# EAGLE design SparkyJrRemorandum (EAGLE 6.2)
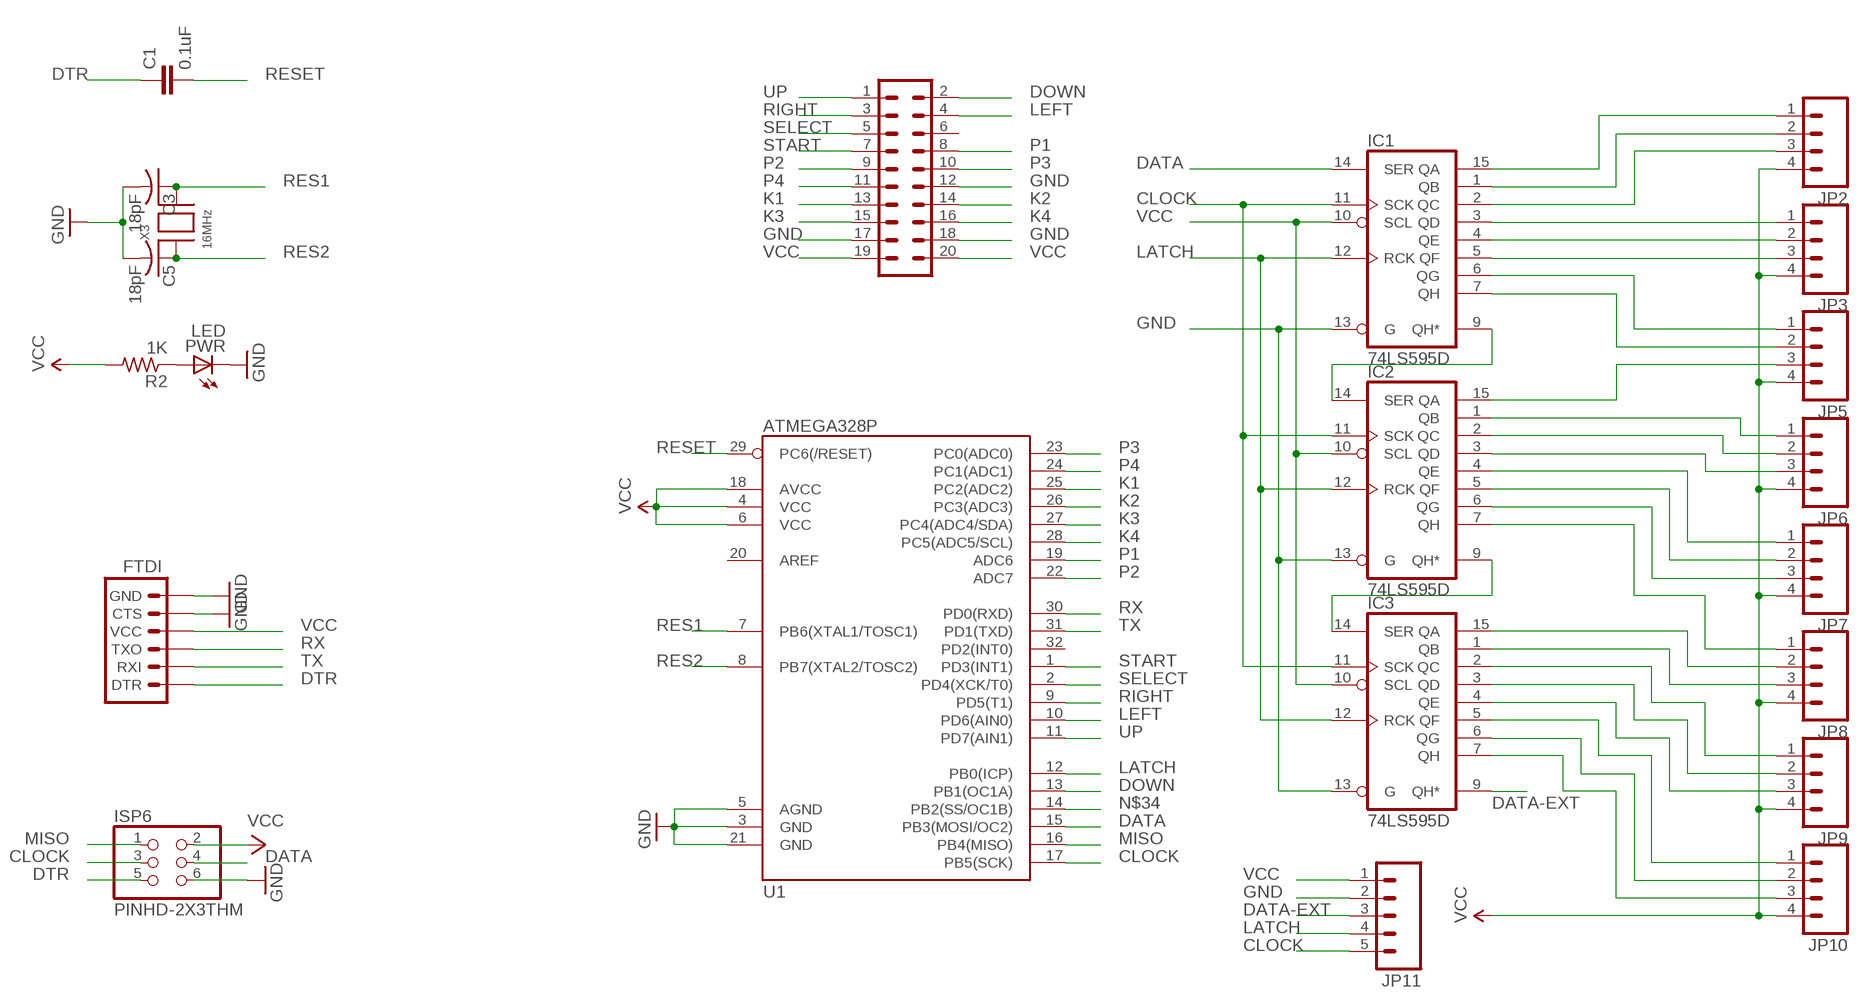
[diagram p0: schematic, sheet 1]

## Parts
C1  0.1uF  CAP0805  [0805]
C3  18pF  C-USC0805K  [C0805K]
C5  18pF  C-USC0805K  [C0805K]
FTDI  ARDUINO_SERIAL_PROGRAMPTH  [1X06]
IC1  74LS595D  [SO16]
IC2  74LS595D  [SO16]
IC3  74LS595D  [SO16]
ISP6  PINHD-2X3THM  PINHD-2X3  [2X03]
JP2  M04PTH  [1X04]
JP3  M04PTH  [1X04]
JP5  M04PTH  [1X04]
JP6  M04PTH  [1X04]
JP7  M04PTH  [1X04]
JP8  M04PTH  [1X04]
JP9  M04PTH  [1X04]
JP10  M04PTH  [1X04]
JP11  M05PTH  [1X05]
PWR  LED  LEDCHIPLED_0805  [CHIPLED_0805]
R2  1K  R-US_R0805  [R0805]
U1  ATMEGA328P  ATMEGA168  [TQFP32-08]
U$1  M10X2NOSILK  [2X10_NOSILK]
X3  16MHz  XTALNX5032  [NX5032]

## Nets
CLOCK: IC1.11(SCK) IC2.11(SCK) IC3.11(SCK) ISP6.3 JP11.5 U1.17(PB5(SCK))
DATA: IC1.14(SER) ISP6.4 U1.15(PB3(MOSI/OC2))
DATA-EXT: IC3.9(QH*) JP11.3
DOWN: U1.13(PB1(OC1A)) U$1.2
DTR: C1.1 FTDI.1(DTR) ISP6.5
GND: C3.2 C5.2 FTDI.5(CTS) FTDI.6(GND) IC1.13(G) IC2.13(G) IC3.13(G) ISP6.6 JP11.2 PWR.C U1.3(GND) U1.5(AGND) U1.21(GND) U$1.12 U$1.17 U$1.18
K1: U1.25(PC2(ADC2)) U$1.13
K2: U1.26(PC3(ADC3)) U$1.14
K3: U1.27(PC4(ADC4/SDA)) U$1.15
K4: U1.28(PC5(ADC5/SCL)) U$1.16
LATCH: IC1.12(RCK) IC2.12(RCK) IC3.12(RCK) JP11.4 U1.12(PB0(ICP))
LEFT: U1.10(PD6(AIN0)) U$1.4
MISO: ISP6.1 U1.16(PB4(MISO))
N$1: PWR.A R2.1
N$2: IC1.9(QH*) IC2.14(SER)
N$3: IC2.9(QH*) IC3.14(SER)
N$4: IC1.15(QA) JP2.1
N$5: IC1.1(QB) JP2.2
N$6: IC1.2(QC) JP2.3
N$7: IC1.3(QD) JP3.1
N$8: IC1.4(QE) JP3.2
N$9: IC1.5(QF) JP3.3
N$10: IC1.6(QG) JP5.1
N$11: IC1.7(QH) JP5.2
N$12: IC2.15(QA) JP5.3
N$13: IC2.1(QB) JP6.1
N$14: IC2.2(QC) JP6.2
N$15: IC2.3(QD) JP6.3
N$16: IC2.4(QE) JP7.1
N$17: IC2.5(QF) JP7.2
N$18: IC2.6(QG) JP7.3
N$19: IC2.7(QH) JP8.1
N$20: IC3.15(QA) JP8.2
N$21: IC3.1(QB) JP8.3
N$22: IC3.2(QC) JP9.1
N$23: IC3.3(QD) JP9.2
N$24: IC3.4(QE) JP9.3
N$25: IC3.5(QF) JP10.1
N$26: IC3.6(QG) JP10.2
N$27: IC3.7(QH) JP10.3
N$34: U1.14(PB2(SS/OC1B))
P1: U1.19(ADC6) U$1.8
P2: U1.22(ADC7) U$1.9
P3: U1.23(PC0(ADC0)) U$1.10
P4: U1.24(PC1(ADC1)) U$1.11
RES1: C3.1 U1.7(PB6(XTAL1/TOSC1)) X3.P$2
RES2: C5.1 U1.8(PB7(XTAL2/TOSC2)) X3.P$1
RESET: C1.2 U1.29(PC6(/RESET))
RIGHT: U1.9(PD5(T1)) U$1.3
RX: FTDI.3(TXO) U1.30(PD0(RXD))
SELECT: U1.2(PD4(XCK/T0)) U$1.5
START: U1.1(PD3(INT1)) U$1.7
TX: FTDI.2(RXI) U1.31(PD1(TXD))
UP: U1.11(PD7(AIN1)) U$1.1
VCC: FTDI.4(VCC) IC1.10(SCL) IC2.10(SCL) IC3.10(SCL) ISP6.2 JP2.4 JP3.4 JP5.4 JP6.4 JP7.4 JP8.4 JP9.4 JP10.4 JP11.1 R2.2 U1.4(VCC) U1.6(VCC) U1.18(AVCC) U$1.19 U$1.20
Unconnected: U1.20(AREF) U1.32(PD2(INT0)) U$1.6

## Power pins joined to a net without a drawn wire
GND: IC1.8(GND) IC2.8(GND) IC3.8(GND)
VCC: IC1.16(VCC) IC2.16(VCC) IC3.16(VCC)

## Library data of the parts
C1 = SparkFun:CAP: Capacitor Standard 0603 ceramic capacitor, and 0.1" leaded capacitor.
C3 C5 = adafruit:C-US: CAPACITOR, American symbol
FTDI = SparkFun:ARDUINO_SERIAL_PROGRAM
IC1-IC3 = 74xx-us:74*595: 8-bit SHIFT REGISTER, output latch
ISP6 = SparkFun:PINHD-2X3: PIN HEADER
JP2 JP3 JP5-JP10 = SparkFun:M04: Header 4 Standard 4-pin 0.1" header. Use with straight break away headers (SKU : PRT-00116), right angle break away headers (PRT-00553), swiss pins (PRT-00743), machine pins (PRT-00117), and female headers (PRT-00115). Molex polarized connector foot print use with SKU : PRT-08231 with associated crimp pins and housings. 1MM SMD Version SKU: PRT-10208
JP11 = SparkFun:M05: Header 5 Standard 5-pin 0.1" header. Use with straight break away headers (SKU : PRT-00116), right angle break away headers (PRT-00553), swiss pins (PRT-00743), machine pins (PRT-00117), and female headers (PRT-00115). Molex polarized connector foot print use with SKU : PRT-08230 with associated crimp pins and housings.
PWR = adafruit:LED: LED OSRAM: - CHIPLED LG R971, LG N971, LY N971, LG Q971, LY Q971, LO R971, LY R971 LH N974, LH R974 LS Q976, LO Q976, LY Q976 LO Q996 - Hyper CHIPLED LW Q18S LB Q993, LB Q99A, LB R99A - SideLED LS A670, LO A670, LY A670, LG A670, LP A670 LB A673, LV A673, LT A673, LW A673 LH A674 LY A675 LS A676, LA A676, LO A676, LY A676, LW A676 LS A679, LY A679, LG A679 - Hyper Micro SIDELED® LS Y876, LA Y876, LO Y876, LY Y876 LT Y87S - SmartLED LW L88C, LW L88S LB L89C, LB L89S, LG L890 LS L89K, LO L89K, LY L89K LS L896, LA L896, LO L896, LY L896 - TOPLED LS T670, LO T670, LY T670, LG T670, LP T670 LSG T670, LSP T670, LSY T670, LOP T670, LYG T670 LG T671, LOG T671, LSG T671 LB T673, LV T673, LT T673, LW T673 LH T674 LS T676, LA T676, LO T676, LY T676, LB T676, LH T676, LSB T676, LW T676 LB T67C, LV T67C, LT T67C, LS T67K, LO T67K, LY T67K, LW E67C LS E67B, LA E67B, LO E67B, LY E67B, LB E67C, LV E67C, LT E67C LW T67C LS T679, LY T679, LG T679 LS T770, LO T770, LY T770, LG T770, LP T770 LB T773, LV T773, LT T773, LW T773 LH T774 LS E675, LA E675, LY E675, LS T675 LS T776, LA T776, LO T776, LY T776, LB T776 LHGB T686 LT T68C, LB T68C - Hyper Mini TOPLED® LB M676 - Mini TOPLED Santana® LG M470 LS M47K, LO M47K, LY M47K Source: http://www.osram.convergy.de/
R2 = adafruit:R-US_: RESISTOR, American symbol
U1 = SparkFun:ATMEGA168
U$1 = SparkFun:M10X2: This was SPECIALLY designed to be used with our Graphic LCD Backpack. Be sure you want to use this! It is not only staggered on each line of header holes, but IT IS ALSO offset of the center point of the top and bottom lines by 5 mil. This causes the headers to lock into place on the "standard" footprint on the LCD screen. The extra squares on the tdocu layer are there simply to reference other pins (if you were to actually populate a longer header than ten long - this is what we do with the backpacks).
X3 = adaprog:XTAL

## Board
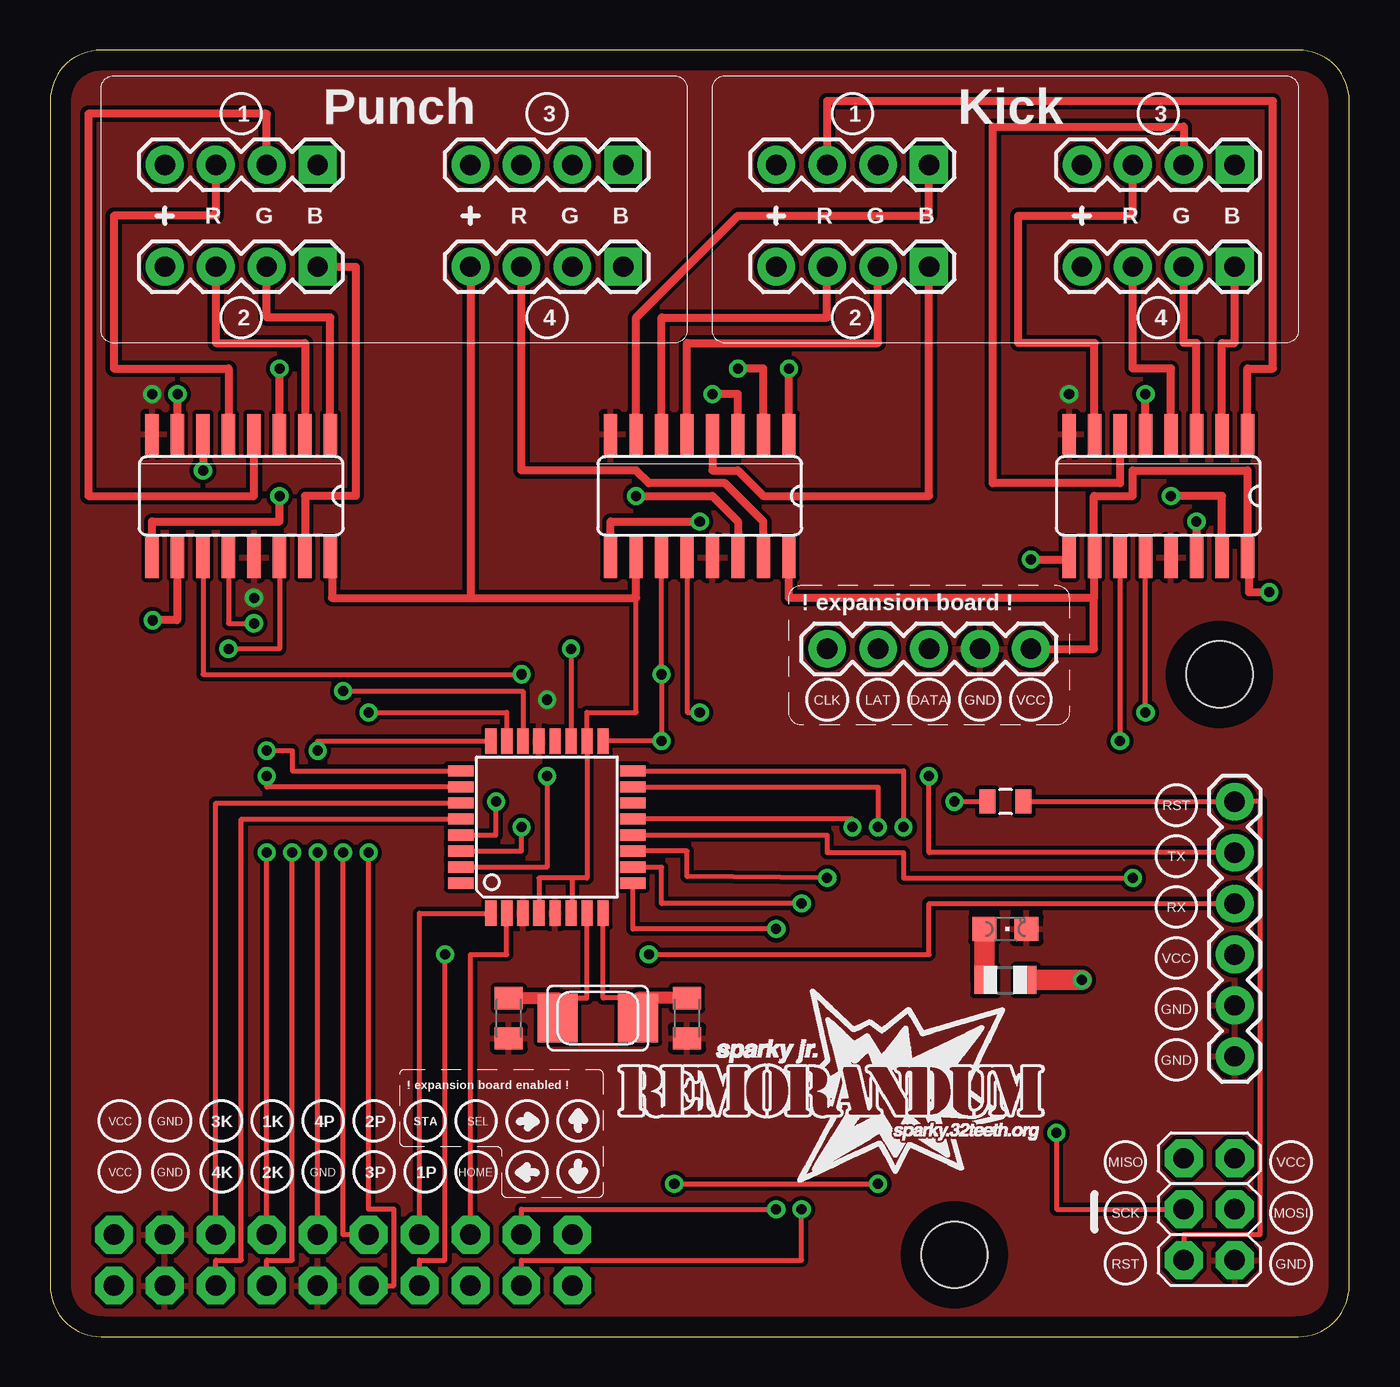
[diagram p1: board, top side]
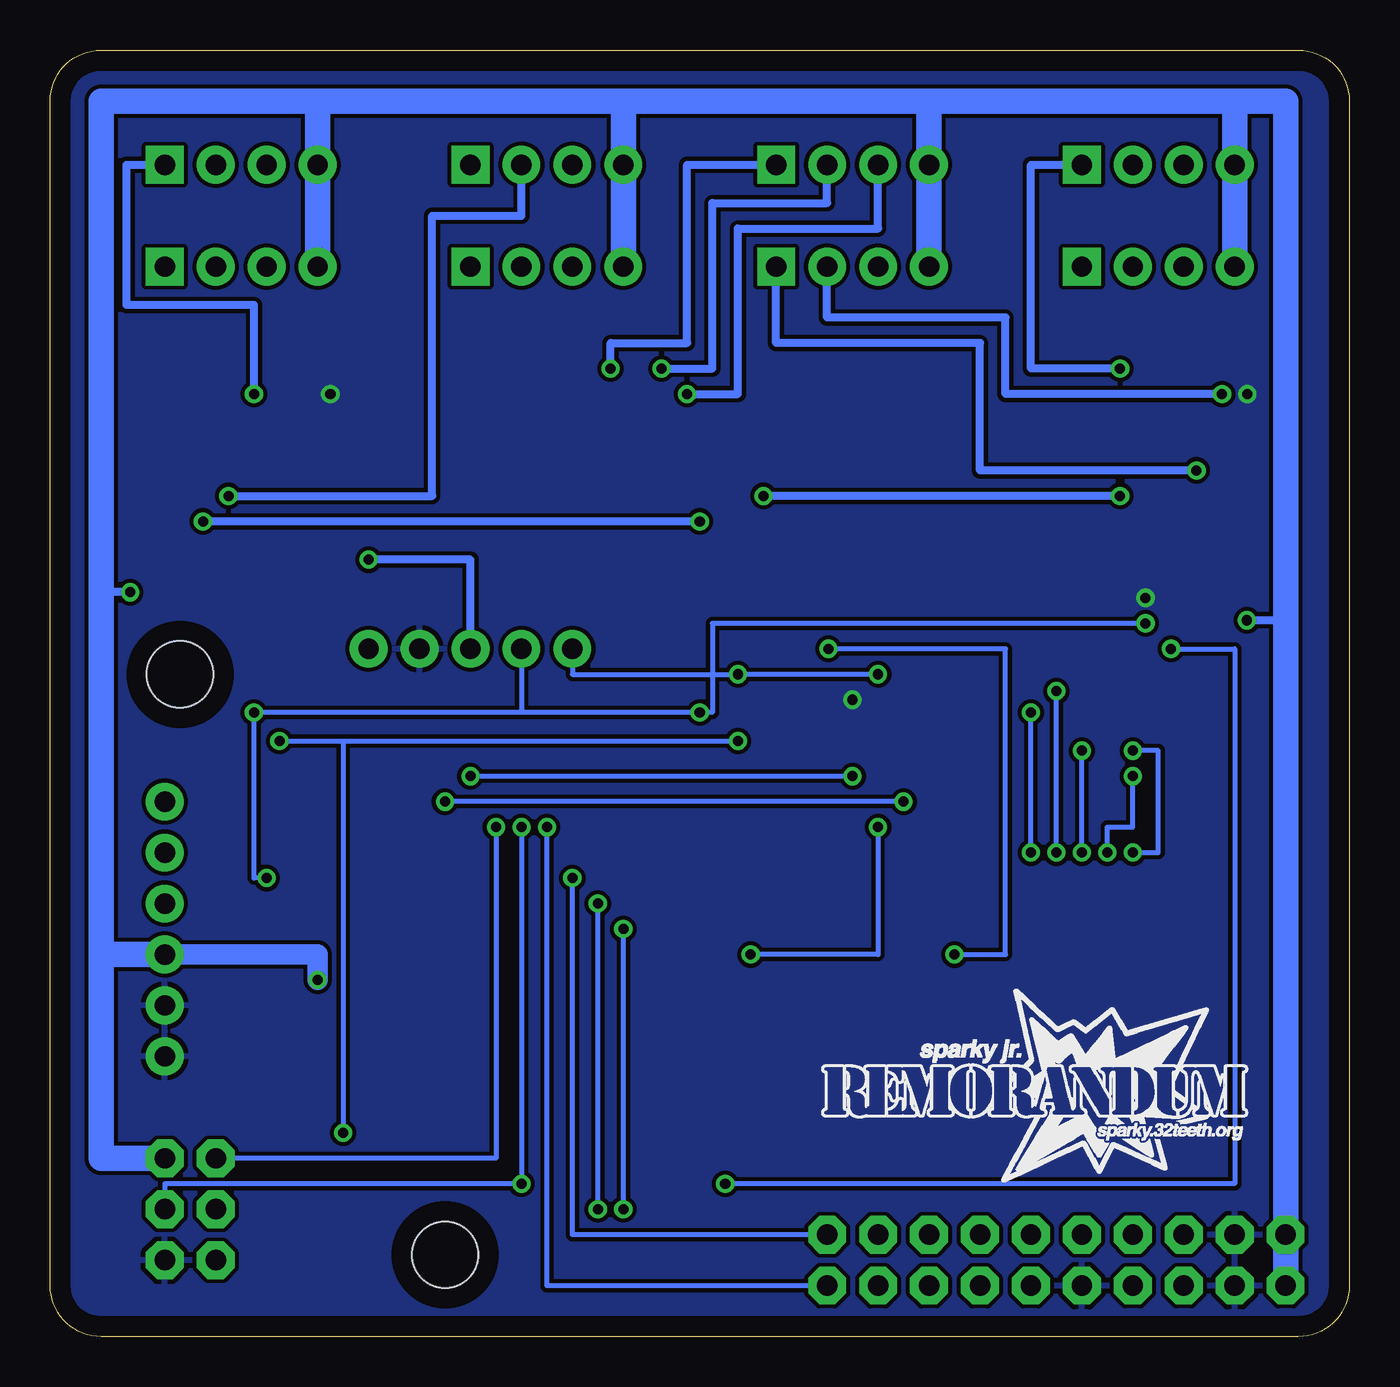
[diagram p2: board, bottom side, seen from below]

Size 64.77 x 64.14 mm. Coordinates in mm from the lower left corner, seen from the top.
Outline: 64.77,2.54 64.77,61.59 arc90 62.23,64.14 2.54,64.14 arc90 0,61.59 0,2.54 arc90 2.54,0 62.23,0 arc90 64.77,2.54
Copper layers (1*16): Top 0.035mm / dielectric 1.5mm / Bottom 0.035mm
Design rules: minimum track width 10mil, minimum drill 24mil, track to track 8mil, track to pad 8mil, pad to pad 8mil, via to via 8mil, smd to smd 8mil, copper to edge 40mil, drill to drill 8mil, minimum pad ring 10mil, minimum via ring 8mil, stop-mask expansion 4mil, vias tented up to drill 0mil, thermal gap 10mil

### Footprints (pad centres in the part's own frame; a part is rotated, then mirrored left to right if it is on the bottom)
0805 = smd 0.8 x 1.2: 1 -0.9,0; 2 0.9,0
C0805K = smd 1.1 x 1.4: 1 -1,0; 2 1,0
1X06 = drill 1.016 pad 1.88: 1 0,0; 2 2.54,0; 3 5.08,0; 4 7.62,0; 5 10.16,0; 6 12.7,0
SO16 = smd 0.66 x 2.032: 1 -4.445,-3.073; 2 -3.175,-3.073; 3 -1.905,-3.073; 4 -0.635,-3.073; 5 0.635,-3.073; 6 1.905,-3.073; 7 3.175,-3.073; 8 4.445,-3.073; 9 4.445,3.073; 10 3.175,3.073; 11 1.905,3.073; 12 0.635,3.073; 13 -0.635,3.073; 14 -1.905,3.073; 15 -3.175,3.073; 16 -4.445,3.073
2X03 = drill 1.016 pad 1.88 octagon: 1 -2.54,-1.27; 2 -2.54,1.27; 3 0,-1.27; 4 0,1.27; 5 2.54,-1.27; 6 2.54,1.27
STAND-OFF = hole 3.302: 0,0
1X04 = drill 1.016 pad 1.88 square: 1 0,0 | drill 1.016 pad 1.88: 2 2.54,0; 3 5.08,0; 4 7.62,0
1X05 = drill 1.016 pad 1.88: 1 0,0; 2 2.54,0; 3 5.08,0; 4 7.62,0; 5 10.16,0
CHIPLED_0805 = smd 1.2 x 1.2: A 0,-1.05; C 0,1.05
R0805 = smd 1.1 x 1.4: 1 -1,0; 2 1,0
TQFP32-08 = smd 1.27 x 0.559: 1 -4.293,2.8; 2 -4.293,2; 3 -4.293,1.2; 4 -4.293,0.4; 5 -4.293,-0.4; 6 -4.293,-1.2; 7 -4.293,-2; 8 -4.293,-2.8; 17 4.293,-2.8; 18 4.293,-2; 19 4.293,-1.2; 20 4.293,-0.4; 21 4.293,0.4; 22 4.293,1.2; 23 4.293,2; 24 4.293,2.8 | smd 0.559 x 1.27: 9 -2.8,-4.293; 10 -2,-4.293; 11 -1.2,-4.293; 12 -0.4,-4.293; 13 0.4,-4.293; 14 1.2,-4.293; 15 2,-4.293; 16 2.8,-4.293; 25 2.8,4.293; 26 2,4.293; 27 1.2,4.293; 28 0.4,4.293; 29 -0.4,4.293; 30 -1.2,4.293; 31 -2,4.293; 32 -2.8,4.293
2X10_NOSILK = drill 1.016 pad 1.88 octagon: 1 -11.43,-1.27; 2 -11.43,1.27; 3 -8.89,-1.27; 4 -8.89,1.27; 5 -6.35,-1.27; 6 -6.35,1.27; 7 -3.81,-1.27; 8 -3.81,1.27; 9 -1.27,-1.27; 10 -1.27,1.27; 11 1.27,-1.27; 12 1.27,1.27; 13 3.81,-1.27; 14 3.81,1.27; 15 6.35,-1.27; 16 6.35,1.27; 17 8.89,-1.27; 18 8.89,1.27; 19 11.43,-1.27; 20 11.43,1.27
NX5032 = smd 2 x 2.4: P$1 2,0; P$2 -2,0

### Placement (x,y rotation side)
C1  47.62,26.67 180 top
C3  22.86,15.88 270 top
C5  31.75,15.88 270 top
FTDI  59.05,26.67 270 top
IC1  9.53,41.91 180 top
IC2  32.38,41.91 180 top
IC3  55.24,41.91 180 top
ISP6  57.78,6.35 270 top
JP1  STAND-OFF  [STAND-OFF]  58.29,33.02 0 top
JP2  13.34,53.34 180 top
JP3  13.34,58.42 180 top
JP4  STAND-OFF  [STAND-OFF]  45.09,4.08 0 top
JP5  28.57,53.34 180 top
JP6  28.57,58.42 180 top
JP7  43.81,53.34 180 top
JP8  43.81,58.42 180 top
JP9  59.05,53.34 180 top
JP10  59.05,58.42 180 top
JP11  48.9,34.29 180 top
PWR  47.62,20.32 270 top
R2  47.62,17.78 0 top
U1  24.77,25.4 90 top
U$1  14.61,3.81 180 top
X3  27.3,15.88 0 top

### Tracks (layer width: path | path; a pad name or v marks a point on that pad's centre or on a via)
CLOCK  (via drill 0.5)
  Top 0.254: IC3.11 v53.34,29.69 | IC2.11 v30.48,33.02 v30.48,29.69 U1.17 | IC1.11 7.62,33.02 v23.5,33.02 | v50.16,10.16 50.16,6.35 ISP6.3
  Bottom 0.254: v30.48,29.69 v53.34,29.69 50.16,29.69 v50.16,10.16 | v23.5,33.02 v30.48,33.02 38.73,33.02 JP11.5
DATA  (via drill 0.5)
  Top 0.254: U1.15 41.27,27.4 v41.27,25.4 | IC1.14 11.43,34.29 v8.89,34.29 | v31.11,7.62 v41.27,7.62
  Bottom 0.254: v41.27,25.4 v41.27,7.62 59.05,7.62 ISP6.4 | v8.89,34.29 5.71,34.29 5.71,7.62 v31.11,7.62
DATA-EXT  (via drill 0.5)
  Top 0.406: v48.9,38.73 50.8,38.73 IC3.9
  Bottom 0.406: JP11.3 43.81,38.73 v48.9,38.73
DOWN  (via drill 0.5)
  Top 0.254: v40.01,25.4 40.01,25.8 U1.13
  Bottom 0.254: U$1.2 40.01,2.54 v40.01,25.4
DTR
  Top 0.254: C1.1 FTDI.1 60.33,26.67 60.33,5.08 56.52,5.08 ISP6.5
GND  (via drill 0.5)
  other vias: 5.08,46.99 50.8,46.99 24.77,31.75 10.16,36.83
  pour Top: 0,64.14 64.77,64.14 64.77,0 0,0
  pour Bottom: 0,64.14 64.77,64.14 64.77,0 0,0
K1  (via drill 0.5)
  Top 0.254: U$1.13 v10.79,24.13 | v10.79,29.21 12.06,29.21 12.06,28.2 U1.25
  Bottom 0.254: v10.79,24.13 9.53,24.13 9.53,29.21 v10.79,29.21
K2  (via drill 0.5)
  Top 0.254: U$1.14 10.79,3.81 12.06,3.81 v12.06,24.13 | U1.26 10.79,27.4 v10.79,27.94
  Bottom 0.254: v12.06,24.13 12.06,25.4 10.79,25.4 v10.79,27.94
K3
  Top 0.254: U$1.15 8.26,26.6 U1.27
K4
  Top 0.254: U$1.16 8.26,3.81 9.53,3.81 9.53,25.8 U1.28
LATCH  (via drill 0.5)
  Top 0.254: U1.12 38.73,25 38.73,24.13 42.55,24.13 42.55,22.86 v53.98,22.86 | v54.61,31.11 IC3.12 | IC2.12 31.75,31.11 v32.38,31.11 | IC1.12 8.89,35.56 v10.16,35.56
  Bottom 0.254: v53.98,22.86 54.61,22.86 v54.61,31.11 41.27,31.11 | 41.27,31.11 v32.38,31.11 31.75,31.11 31.75,35.56 v10.16,35.56 | JP11.4 41.27,31.11
LEFT  (via drill 0.5)
  Top 0.254: U$1.4 23.5,3.81 37.47,3.81 v37.47,6.35 | v37.47,21.59 30.48,21.59 30.48,23.4 U1.10
  Bottom 0.254: v37.47,6.35 v37.47,21.59
MISO  (via drill 0.5)
  Top 0.254: U1.16 42.55,28.2 v42.55,25.4
  Bottom 0.254: v42.55,25.4 42.55,8.89 ISP6.1
N$1
  Top 1.016: R2.1 46.58,17.78 PWR.A
N$2  (via drill 0.5)
  Top 0.406: IC1.9 5.08,40.64 11.43,40.64 v11.43,41.91 | v29.21,41.91 33.02,41.91 34.29,40.64 IC2.14
  Bottom 0.406: v11.43,41.91 v29.21,41.91
N$3  (via drill 0.5)
  Top 0.406: IC2.9 27.94,40.64 v32.38,40.64 | v57.15,40.64 IC3.14
  Bottom 0.406: v32.38,40.64 v57.15,40.64
N$4
  Top 0.406: JP2.1 15.24,53.34 15.24,41.91 12.7,41.91 IC1.15
N$5
  Top 0.406: IC1.1 13.97,50.8 10.79,50.8 JP2.2
N$6
  Top 0.406: JP2.3 8.26,49.53 12.7,49.53 IC1.2
N$7  (via drill 0.5)
  Top 0.406: IC1.3 v11.43,48.26
  Bottom 0.406: v11.43,48.26 15.88,48.26 15.88,58.42 JP3.1
N$8
  Top 0.254: 9.98,44.91 IC1.4
  Top 0.406: JP3.2 10.79,60.96 1.91,60.96 1.91,41.91 10.16,41.91 IC1.4
N$9
  Top 0.406: JP3.3 8.26,55.88 3.17,55.88 3.17,48.26 8.89,48.26 IC1.5
N$10  (via drill 0.5)
  Top 0.406: IC1.6 v7.62,43.18
  Bottom 0.406: v7.62,43.18 18.41,43.18 18.41,49.53 28.57,49.53 JP5.1
N$11  (via drill 0.5)
  Top 0.406: IC1.7 v6.35,46.99
  Bottom 0.406: v6.35,46.99 17.14,46.99 17.14,50.8 26.04,50.8 JP5.2
N$12
  Top 0.406: IC2.15 35.56,40.64 33.66,42.55 29.84,42.55 29.21,43.18 23.5,43.18 JP5.3
N$13  (via drill 0.5)
  Top 0.406: IC2.1 v36.83,48.26
  Bottom 0.406: v36.83,48.26 36.83,49.53 33.02,49.53 33.02,58.42 JP6.1
N$14  (via drill 0.5)
  Top 0.406: IC2.2 35.56,48.26 v34.29,48.26
  Bottom 0.406: v34.29,48.26 31.75,48.26 31.75,56.52 26.04,56.52 JP6.2
N$15  (via drill 0.5)
  Top 0.406: IC2.3 34.29,46.99 v33.02,46.99
  Bottom 0.406: v33.02,46.99 30.48,46.99 30.48,55.24 23.5,55.24 JP6.3
N$16
  Top 0.406: IC2.4 33.02,43.18 34.29,43.18 35.56,41.91 43.81,41.91 JP7.1
N$17
  Top 0.406: IC2.5 31.75,49.53 41.27,49.53 JP7.2
N$18
  Top 0.406: IC2.6 30.48,50.8 38.73,50.8 JP7.3
N$19
  Top 0.406: IC2.7 29.21,50.8 34.29,55.88 43.81,55.88 JP8.1
N$20  (via drill 0.5)
  Top 0.406: IC3.15 58.42,41.91 v55.88,41.91
  Bottom 0.406: v55.88,41.91 45.72,41.91 45.72,55.88 41.27,55.88 JP8.2
N$21
  Top 0.406: IC3.1 59.69,48.26 60.96,48.26 60.96,61.59 38.73,61.59 JP8.3
N$22
  Top 0.406: IC3.2 58.42,49.53 59.05,49.53 JP9.1
N$23
  Top 0.406: IC3.3 57.15,49.53 56.52,49.53 JP9.2
N$24
  Top 0.406: IC3.4 55.88,48.26 53.98,48.26 JP9.3
N$25  (via drill 0.5)
  Top 0.406: IC3.5 v54.61,46.99
  Bottom 0.406: v54.61,46.99 54.61,51.44 60.96,51.44 60.96,58.42 JP10.1
N$26
  Top 0.406: IC3.6 53.34,42.55 46.99,42.55 46.99,60.33 56.52,60.33 JP10.2
N$27
  Top 0.406: IC3.7 52.07,49.53 48.26,49.53 48.26,55.88 53.98,55.88 JP10.3
P1  (via drill 0.5)
  Top 0.254: U$1.8 18.41,3.81 19.68,3.81 v19.68,19.05 | v25.96,34.29 U1.19
  Bottom 0.254: v19.68,19.05 17.14,19.05 17.14,34.29 v25.96,34.29
P2  (via drill 0.5)
  Top 0.254: U$1.9 14.61,5.08 v14.61,24.13 | v14.61,32.18 23.57,32.18 U1.22
  Bottom 0.254: v14.61,24.13 v14.61,32.18
P3  (via drill 0.5)
  Top 0.254: U$1.10 17.14,2.54 17.14,6.35 15.88,6.35 v15.88,24.13 | v15.88,31.11 22.77,31.11 U1.23
  Bottom 0.254: v15.88,24.13 v15.88,31.11
P4  (via drill 0.5)
  Top 0.254: U$1.11 v13.34,24.13 | v13.34,29.21 13.34,29.69 U1.24
  Bottom 0.254: v13.34,24.13 v13.34,29.21
RES1
  Top 0.254: 25.3,16.88 26.77,16.88 U1.7
  Top 0.61: C3.1 25.3,16.88 X3.P$2
RES2
  Top 0.254: 29.3,16.88 27.57,16.88 U1.8
  Top 0.61: C5.1 29.3,16.88 X3.P$1
RESET  (via drill 0.5)
  Top 0.254: U1.29 22.23,25 v22.23,26.67 | v45.09,26.67 C1.2
  Bottom 0.254: v22.23,26.67 v45.09,26.67
RIGHT  (via drill 0.5)
  Top 0.254: U$1.3 23.5,6.35 v36.2,6.35 | v36.2,20.32 29.06,20.32 U1.9
  Bottom 0.254: v36.2,6.35 v36.2,20.32
RX  (via drill 0.5)
  Top 0.254: U1.30 23.5,24.2 v23.5,25.4 | v29.84,19.05 43.81,19.05 43.81,21.59 FTDI.3
  Bottom 0.254: v23.5,25.4 23.5,19.05 v29.84,19.05
SELECT
  Top 0.254: U$1.5 20.95,19.05 22.77,19.05 U1.2
START
  Top 0.254: U$1.7 18.41,21.11 U1.1
TX  (via drill 0.5)
  Top 0.254: FTDI.2 43.81,24.13 v43.81,27.94 | U1.31 24.77,23.4 v24.77,27.94
  Bottom 0.254: v43.81,27.94 v24.77,27.94
UP  (via drill 0.5)
  Top 0.254: v38.73,22.86 31.75,22.93 31.75,24.2 U1.11
  Bottom 0.254: U$1.1 38.73,5.08 v38.73,22.86
VCC  (via drill 0.5)
  Top 0.254: 26.04,22.86 26.77,22.86 U1.18 26.77,31.11 29.21,31.11 IC2.10 29.29,38 | 26.04,22.86 24.36,22.86 U1.4 | U1.6 26.04,21.11 26.04,22.86 | 14.05,38.81 IC1.16 | 6.33,38.2 6.33,38.81 IC1.10 | 37.01,39.01 IC2.16 | 59.56,39.62 59.56,39.37 59.56,39.01 IC3.16 59.77,39.01 | 52.25,39.22 52.05,39.42 IC3.10 52.05,39.01 52.25,39.22
  Top 0.406: 6.33,38.2 6.33,35.71 v5.11,35.71 | 14.05,38.81 14.05,36.83 20.95,36.83 | 20.95,36.83 29.21,36.83 IC2.10 | JP5.4 20.95,36.83 | 52.05,36.83 52.05,39.42 52.05,41.91 53.98,41.91 53.98,43.18 59.69,43.18 59.69,39.37 59.56,39.37 | 52.05,36.83 36.83,36.83 IC2.16 | 59.77,39.01 59.77,37.11 v60.78,37.11 | JP11.1 52.05,34.29 52.05,36.83
  Top 1.016: v51.44,17.78 R2.2
  Bottom 0.406: v5.11,35.71 3.17,35.71 | v60.78,37.11 62.23,37.11 62.23,38.1
  Bottom 1.016: FTDI.4 51.44,19.05 v51.44,17.78
  Bottom 1.27: JP2.4 JP3.4 5.71,61.59 | 5.71,61.59 3.17,61.59 3.17,35.71 U$1.19 U$1.20 | 20.95,61.59 JP6.4 JP5.4 | 20.95,61.59 5.71,61.59 | 36.2,61.59 JP8.4 JP7.4 | 36.2,61.59 20.95,61.59 | 51.44,61.59 JP10.4 JP9.4 | 51.44,61.59 36.2,61.59 | FTDI.4 62.23,19.05 | 62.23,19.05 62.23,38.1 62.23,61.59 51.44,61.59 | ISP6.2 62.23,8.89 62.23,19.05

### Text on the board
tPlace: 1 | Punch | 3 | 1 | Kick | 3 | R | G | B | R | G | B | R | G | B | R | G | B | 2 | 4 | 2 | 4 | ! expansion board ! | CLK | LAT | DATA | GND | VCC | RST | TX | RX | VCC | GND | GND | ! expansion board enabled ! | VCC | GND | 3K | 1K | 4P | 2P | STA | SEL | 4K | 2K | 3P | 1P | MISO | VCC | VCC | GND | GND | HOME | SCK | MOSI | RST | GND